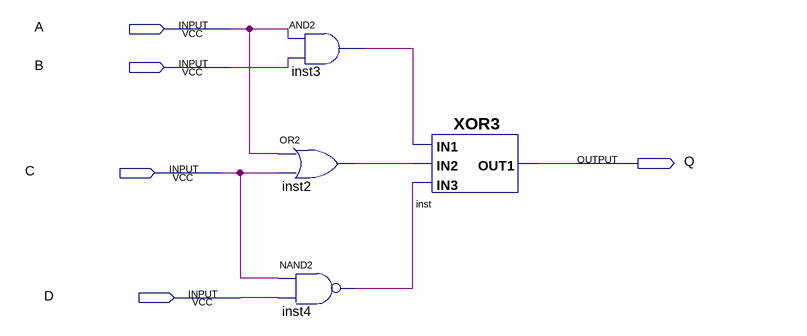
[diagram p0: schematic sheet]
// Quartus schematic Block1.bdf as structural Verilog: 4 symbols, 5 pins
module Block1 (
  input  A,
  input  B,
  input  C,
  input  D,
  output Q
);

  wire inst2_out, inst3_out, inst4_out;

  and inst3 (inst3_out, A, B);
  or inst2 (inst2_out, A, C);
  nand inst4 (inst4_out, C, D);
  XOR3 inst (.IN3(inst4_out), .IN1(inst3_out), .IN2(inst2_out), .OUT1(Q));
endmodule
